# Altium schematic sheet avr910_bluetooth.SchDoc
size A4
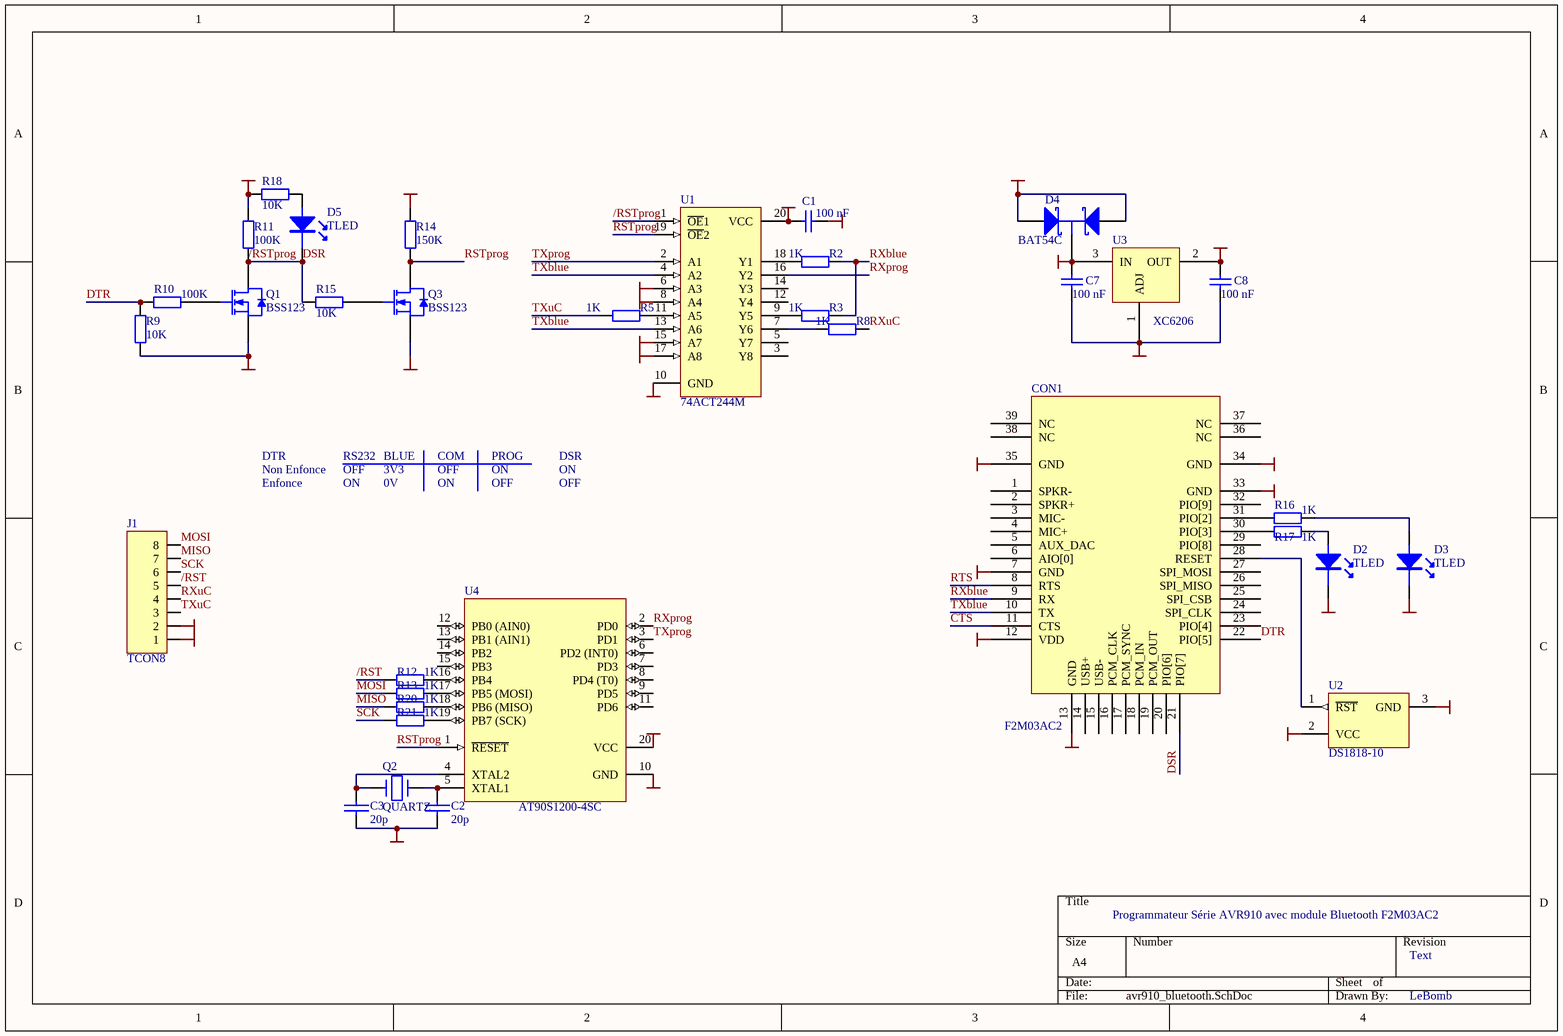
[diagram p0: avr910_bluetooth.SchDoc]

## Parts
C1  value 100 nF  [0805]  (hidden comment: Cap)
C2  20p  [0805]
C3  20p  [0805]
C7  value 100 nF  [0805]  (hidden comment: Cap)
C8  value 100 nF  [0805]  (hidden comment: Cap)
CON1  F2M03AC2  [F2M03AC2_conn]
D2  TLED  [0805]
D3  TLED  [0805]
D4  BAT54C  [SOT23]
D5  TLED  [0805]
J1  TCON8  [TSIP8]
Q1  BSS123  [SOT23]
Q2  QUARTZ  [XTAL1]
Q3  BSS123  [SOT23]
R2  value 1K  [0805]  (hidden comment: Res2)
R3  value 1K  [0805]  (hidden comment: Res2)
R5  value 1K  [0805]  (hidden comment: Res2)
R8  value 1K  [0805]  (hidden comment: Res2)
R9  value 10K  [0805]  (hidden comment: Res2)
R10  value 100K  [0805]  (hidden comment: Res2)
R11  value 100K  [0805]  (hidden comment: Res2)
R12  value 1K  [0805]  (hidden comment: Res2)
R13  value 1K  [0805]  (hidden comment: Res2)
R14  value 150K  [0805]  (hidden comment: Res2)
R15  value 10K  [0805]  (hidden comment: Res2)
R16  value 1K  [0805]  (hidden comment: Res2)
R17  value 1K  [0805]  (hidden comment: Res2)
R18  value 10K  [0805]  (hidden comment: Res2)
R20  value 1K  [0805]  (hidden comment: Res2)
R21  value 1K  [0805]  (hidden comment: Res2)
U1  74ACT244M  [SO20]
U2  DS1818-10  [SOT-23]
U3  XC6206  [sot-23]
U4  AT90S1200-4SC  [20S]

## Nets
3V3: C1.1 C8.2 CON1.12(VDD) R11.2 R14.2 R18.2 U1.20(VCC) U2.2(VCC) U3.2(OUT)
5V: C7.2 D4.3(K) U3.3(IN) U4.20(VCC)
GND: C1.2 C2.2 C3.2 C7.1 C8.1 CON1.7(GND) CON1.13(GND) CON1.33(GND) CON1.34(GND) CON1.35(GND) D2.2 D3.2 J1.2 Q1.2(S) Q3.2(S) R9.1 U1.6(A3) U1.8(A4) U1.10(GND) U1.15(A7) U1.17(A8) U2.3(GND) U3.1(ADJ) U4.10(GND)
VCC: D4.1(A1) D4.2(A2) J1.1
/RST: J1.5 R12.2
/RSTprog: CON1.21(PIO[7]) D5.2 Q1.3(D) R11.1 R15.2 U1.1(~{OE}1)  [also labelled DSR]
CTS: CON1.11(CTS)
DTR: CON1.22(PIO[5]) R9.2 R10.1
MISO: J1.7 R20.2
MOSI: J1.8 R13.2
RSTprog: Q3.3(D) R14.1 U1.19(~{OE}2) U4.1(~{RESET})
RTS: CON1.8(RTS)
RXblue: CON1.9(RX) R2.2 R3.2
RXprog: U1.16(Y2) U4.2(PD0)
RXuC: J1.4 R8.2
SCK: J1.6 R21.2
TXblue: CON1.10(TX) U1.4(A2) U1.13(A6)
TXprog: U1.2(A1) U4.3(PD1)
TXuC: J1.3 R5.1
NetC2_1: C2.1 Q2.2 U4.5(XTAL1)
NetC3_1: C3.1 Q2.1 U4.4(XTAL2)
NetCON1_28: CON1.28(RESET) U2.1(~{RST})
NetCON1_30: CON1.30(PIO[3]) R17.1
NetCON1_31: CON1.31(PIO[2]) R16.1
NetD2_1: D2.1 R17.2
NetD3_1: D3.1 R16.2
NetD5_1: D5.1 R18.1
NetQ1_1: Q1.1(G) R10.2
NetQ3_1: Q3.1(G) R15.1
NetR2_1: R2.1 U1.18(Y1)
NetR3_1: R3.1 U1.9(Y5)
NetR5_2: R5.2 U1.11(A5)
NetR8_1: R8.1 U1.7(Y6)
NetR12_1: R12.1 U4.16(PB4)
NetR13_1: R13.1 U4.17(PB5_(MOSI))
NetR20_1: R20.1 U4.18(PB6_(MISO))
NetR21_1: R21.1 U4.19(PB7_(SCK))

Not connected (* = marked no-connect by the designer): CON1 1(SPKR-) 2(SPKR+) 3(MIC-) 4(MIC+) 5(AUX_DAC) 6(AIO[0]) 14(USB+) 15(USB-) 16(PCM_CLK) 17(PCM_SYNC) 18(PCM_IN) 19(PCM_OUT) 20(PIO[6]) 23(PIO[4]) 24(SPI_CLK) 25(SPI_CSB) 26(SPI_MISO) 27(SPI_MOSI) 29(PIO[8]) 32(PIO[9]) 36(NC) 37(NC) 38(NC) 39(NC); U1 3(Y8) 5(Y7) 12(Y4) 14(Y3); U4 6(PD2_(INT0)) 7(PD3) 8(PD4_(T0)) 9(PD5) 11(PD6) 12(PB0_(AIN0)) 13(PB1_(AIN1)) 14(PB2) 15(PB3)

## Notes on the sheet
- DTR
- Non Enfonce
- Enfonce
- RS232
- OFF
- ON
- BLUE
- 3V3
- 0V
- COM
- PROG
- DSR
- Programmateur Série AVR910 avec module Bluetooth F2M03AC2
- Text
- LeBomb

## Library data of the parts
C1 C7 C8 = Cap: Capacitor; Published: 8-Jun-2000; Revision: July-2002: Re-released for DXP Platform.; Publisher: Altium Limited
C2 C3 = CONDO
D4 = BAT54C: Schottky Barrier Double Diode; Published: 17-Sep-2003; DatasheetDocument: 4-Mar-2002; PackageDocument: May-1999; PackageReference: SOT23; Publisher: Altium Limited
Q1 Q3 = BSS123: N-channel Enhancement Mode Vertical D-MOSFET; Published: 17-Sep-2003; DatasheetDocument: Apr-1995; PackageDocument: May-1999; PackageReference: SOT23; Publisher: Altium Limited
R2 R3 R5 R8-R18 R20 R21 = Res2: Resistor; Published: 8-Jun-2000; Revision: July-2002: Re-released for DXP Platform.; Publisher: Altium Limited
U1 = 74ACT244M: Octal Bus Buffer with 3 State Outputs (Non Inverted); Published: 8-Jun-2000; LatestRevisionDate: 6-Jun-2005; LatestRevisionNote: Stylized 3D Model Added.; DatasheetDocument: Feb-1999; PackageDocument: Jul-2001; PackageReference: SO20; Publisher: Altium Limited; Code_JEDEC: MS-013-AC; Code_IPC: SO20W; ComponentLink1Description: Manufacturer Link; ComponentLink1URL: http://www.st.com/; ComponentLink2Description: Datasheet; ComponentLink2URL: http://www.st.com/stonline/products/literature/ds/4825/74act244.pdf
U2 = DS1818-10: 3.3V EconoReset with Pushbutton; Published: 13-Oct-2000; LatestRevisionDate: 17-Jul-2002; LatestRevisionNote: Re-released for DXP Platform.; DatasheetDocument: 7-May-1998; PackageDocument: Feb-1999; PackageReference: TO-92; Publisher: Altium Limited; ComponentLink1Description: Manufacturer Link; ComponentLink1URL: http://www.maxim-ic.com/; ComponentLink2Description: Datasheet; ComponentLink2URL: http://pdfserv.maxim-ic.com/en/ds/DS1818.pdf
U3 = LM317
U4 = AT90S1200-4SC: 8-Bit AVR Microcontroller with 1K Byte of In-System Programmable Flash Memory; Published: 17-Sep-2003; DatasheetDocument: 0838H-AVR-03/02; PackageDocument: Aug-1999; PackageReference: 20S; Publisher: Altium Limited